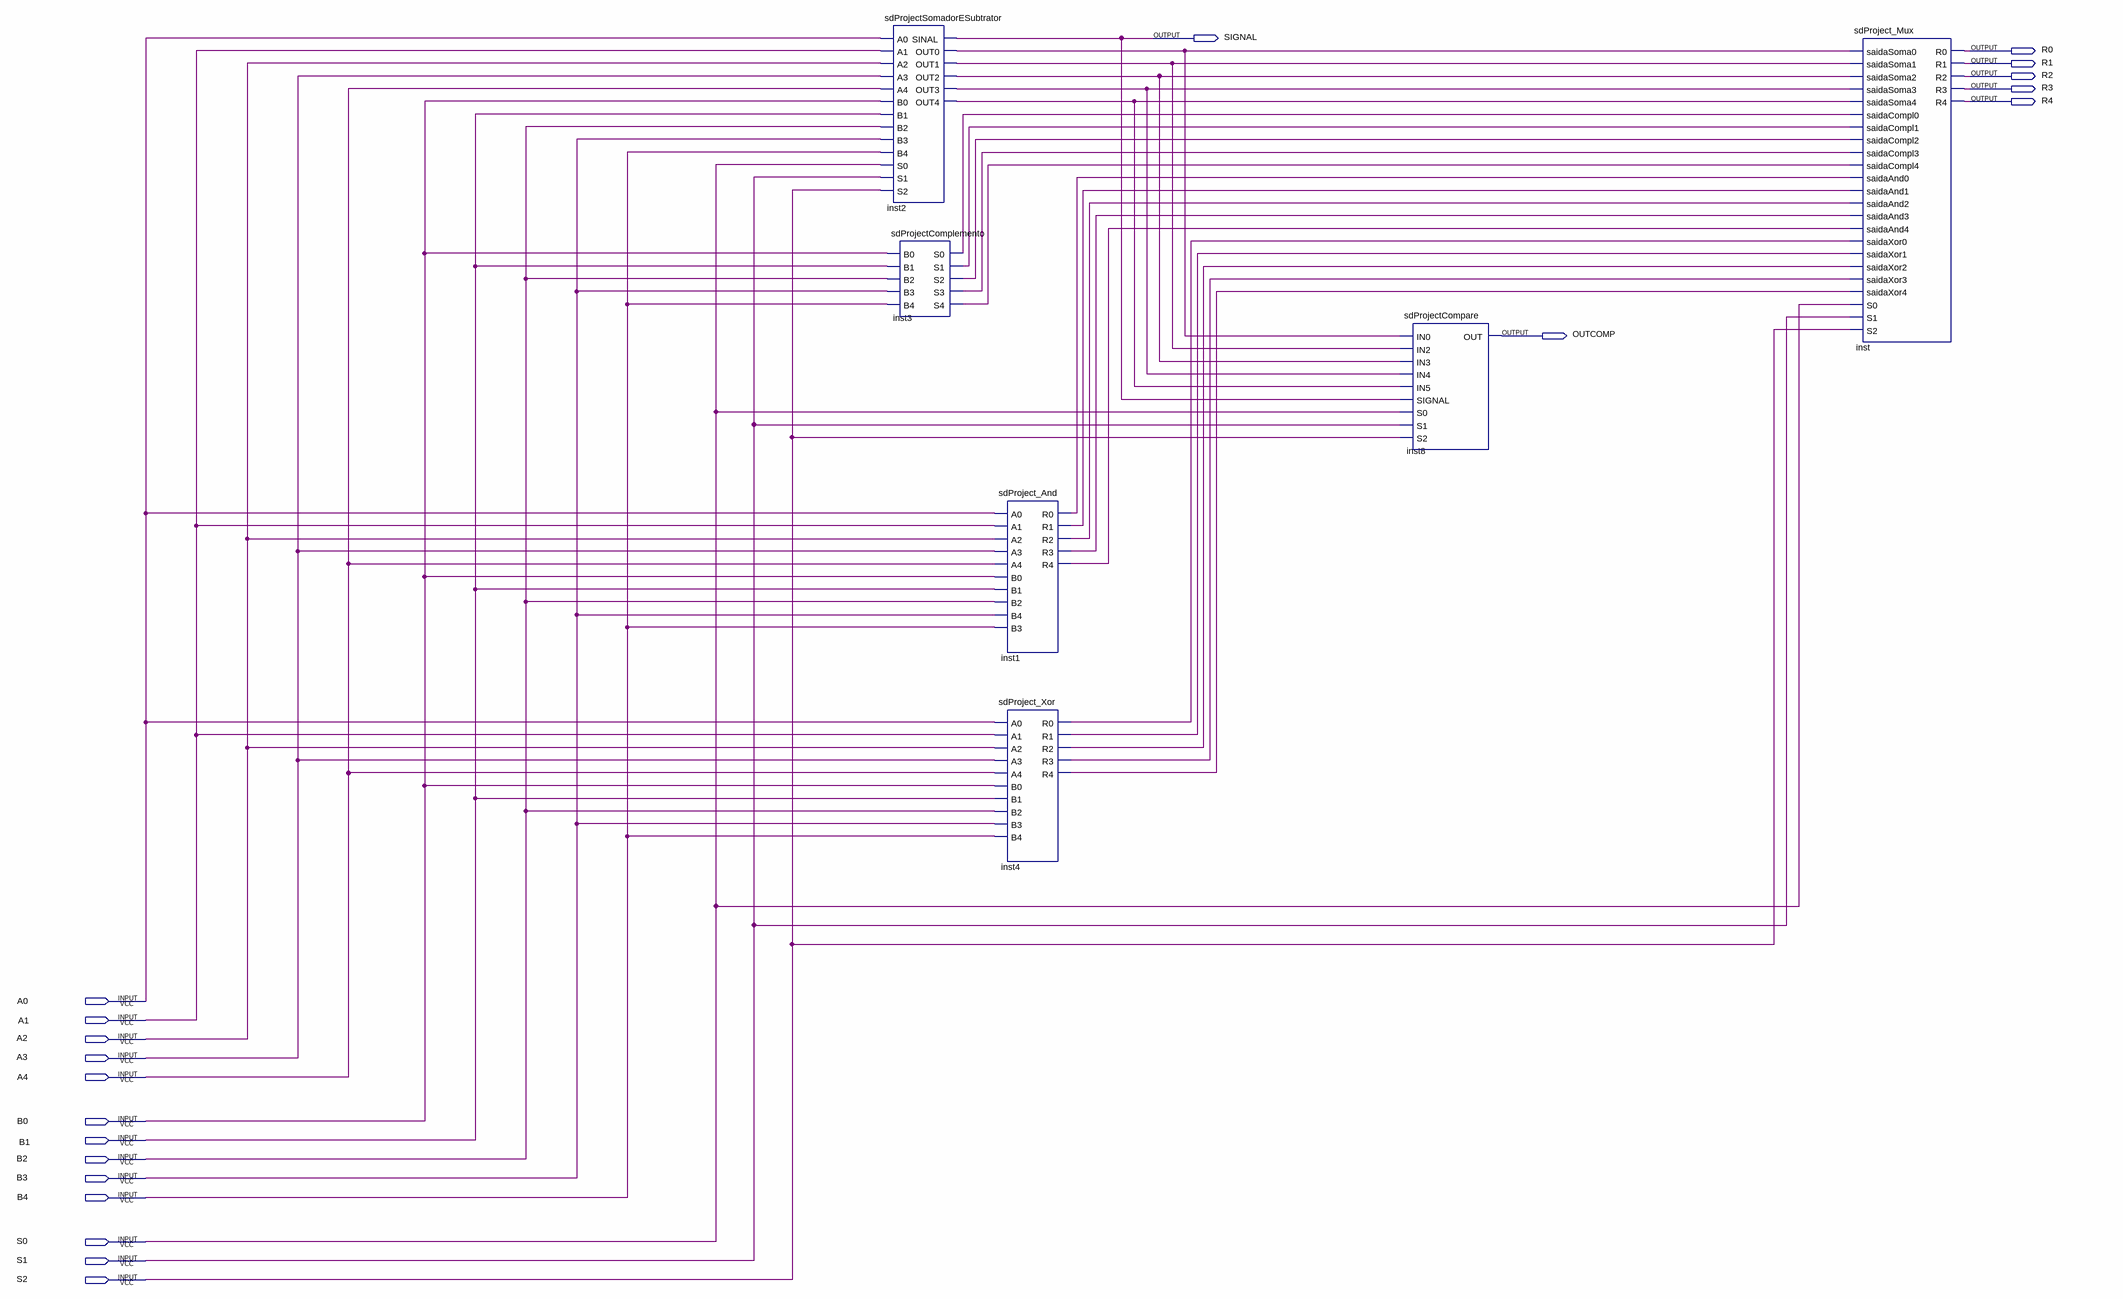
[diagram p0: schematic sheet]
// Quartus schematic sdProjectULA.bdf as structural Verilog: 6 symbols, 20 pins
module sdProjectULA (
  input  A0,
  input  A1,
  input  A2,
  input  A3,
  input  A4,
  input  B0,
  input  B1,
  input  B2,
  input  B3,
  input  B4,
  input  S0,
  input  S1,
  input  S2,
  output SIGNAL,
  output R0,
  output R1,
  output R2,
  output R3,
  output R4,
  output OUTCOMP
);

  wire inst1_r0, inst1_r1, inst1_r2, inst1_r3, inst1_r4, inst2_out0, inst2_out1, inst2_out2, inst2_out3,
       inst2_out4, inst3_s0, inst3_s1, inst3_s2, inst3_s3, inst3_s4, inst4_r0, inst4_r1, inst4_r2, inst4_r3,
       inst4_r4;

  sdProjectSomadorESubtrator inst2 (
    .A0(A0), .A1(A1), .A2(A2), .A3(A3), .A4(A4), .B0(B0), .B1(B1), .B2(B2), .B3(B3), .B4(B4), .S0(S0),
    .S1(S1), .S2(S2), .SINAL(SIGNAL), .OUT0(inst2_out0), .OUT1(inst2_out1), .OUT2(inst2_out2),
    .OUT3(inst2_out3), .OUT4(inst2_out4));
  sdProjectComplemento inst3 (
    .B0(B0), .B1(B1), .B2(B2), .B3(B3), .B4(B4), .S0(inst3_s0), .S1(inst3_s1), .S2(inst3_s2), .S3(inst3_s3),
    .S4(inst3_s4));
  sdProject_And inst1 (
    .A0(A0), .A1(A1), .A2(A2), .A3(A3), .A4(A4), .B0(B0), .B1(B1), .B2(B2), .B4(B3), .B3(B4), .R0(inst1_r0),
    .R1(inst1_r1), .R2(inst1_r2), .R3(inst1_r3), .R4(inst1_r4));
  sdProject_Xor inst4 (
    .A0(A0), .A1(A1), .A2(A2), .A3(A3), .A4(A4), .B0(B0), .B1(B1), .B2(B2), .B3(B3), .B4(B4), .R0(inst4_r0),
    .R1(inst4_r1), .R2(inst4_r2), .R3(inst4_r3), .R4(inst4_r4));
  sdProjectCompare inst8 (
    .IN0(inst2_out0), .IN2(inst2_out1), .IN3(inst2_out2), .IN4(inst2_out3), .IN5(inst2_out4),
    .SIGNAL(SIGNAL), .S0(S0), .S1(S1), .S2(S2), .OUT(OUTCOMP));
  sdProject_Mux inst (
    .saidaSoma0(inst2_out0), .saidaSoma1(inst2_out1), .saidaSoma2(inst2_out2), .saidaSoma3(inst2_out3),
    .saidaSoma4(inst2_out4), .saidaCompl0(inst3_s0), .saidaCompl1(inst3_s1), .saidaCompl2(inst3_s2),
    .saidaCompl3(inst3_s3), .saidaCompl4(inst3_s4), .saidaAnd0(inst1_r0), .saidaAnd1(inst1_r1),
    .saidaAnd2(inst1_r2), .saidaAnd3(inst1_r3), .saidaAnd4(inst1_r4), .saidaXor0(inst4_r0),
    .saidaXor1(inst4_r1), .saidaXor2(inst4_r2), .saidaXor3(inst4_r3), .saidaXor4(inst4_r4), .S0(S0), .S1(S1),
    .S2(S2), .R0(R0), .R1(R1), .R2(R2), .R3(R3), .R4(R4));
endmodule
